# Altium schematic sheet Э3-2 УВ Компаратор.SchDoc
size 594 x 420 mm; Address1: Address1; Address2: Address2; Address3: Address3; Address4: Address4; DocumentNumber: АБВГ.123456.001 Э3; SheetNumber: 3; SheetTotal: 7; Scale: 1:1; DocumentType: Схема электрическая принципиальная; FirstReferrence: АБВГ.123456.001
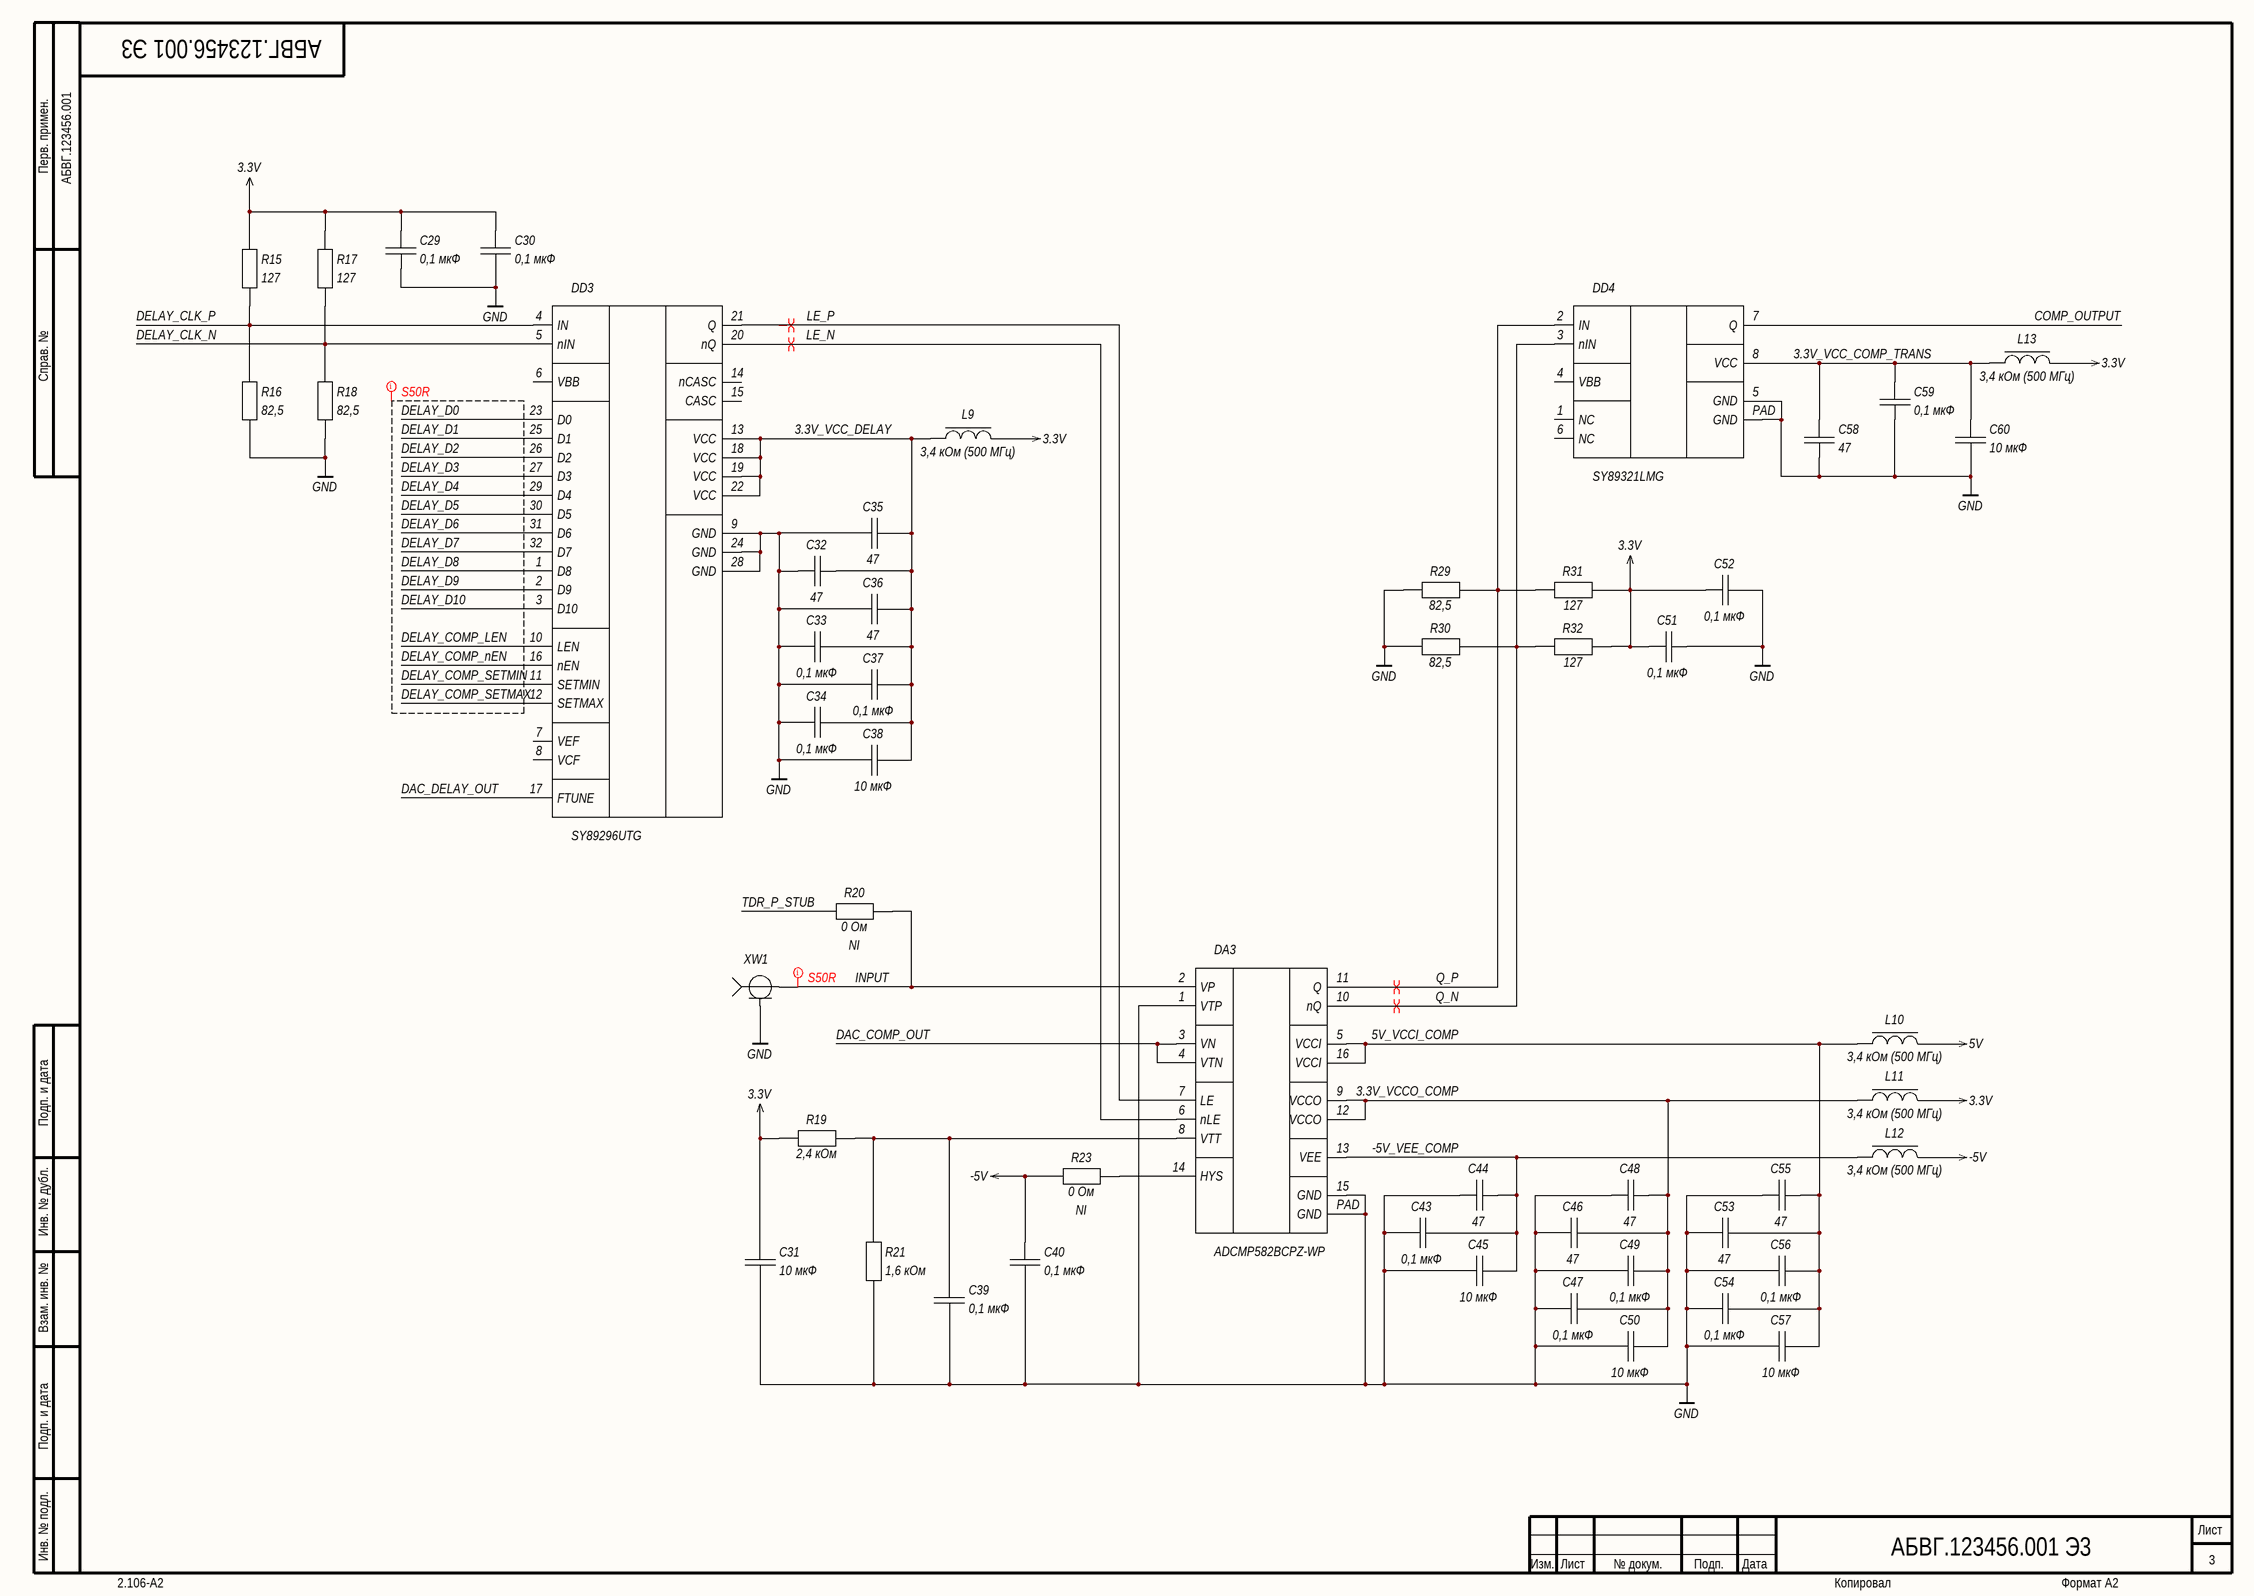
[diagram p0: Э3-2 УВ Компаратор.SchDoc]

## Parts
C29  value 0,1 мкФ  [C0402-B-0.5mm]
C30  value 0,1 мкФ  [C0402-B-0.5mm]
C31  value 10 мкФ  [C0603-B-0.8mm]
C32  value 47  [C0402-B-0.5mm]
C33  value 0,1 мкФ  [C0402-B-0.5mm]
C34  value 0,1 мкФ  [C0402-B-0.5mm]
C35  value 47  [C0402-B-0.5mm]
C36  value 47  [C0402-B-0.5mm]
C37  value 0,1 мкФ  [C0402-B-0.5mm]
C38  value 10 мкФ  [C0603-B-0.8mm]
C39  value 0,1 мкФ  [C0402-B-0.5mm]
C40  value 0,1 мкФ  [C0402-B-0.5mm]
C43  value 0,1 мкФ  [C0402-B-0.5mm]
C44  value 47  [C0402-B-0.5mm]
C45  value 10 мкФ  [C0603-B-0.8mm]
C46  value 47  [C0402-B-0.5mm]
C47  value 0,1 мкФ  [C0402-B-0.5mm]
C48  value 47  [C0402-B-0.5mm]
C49  value 0,1 мкФ  [C0402-B-0.5mm]
C50  value 10 мкФ  [C0603-B-0.8mm]
C51  value 0,1 мкФ  [C0402-B-0.5mm]
C52  value 0,1 мкФ  [C0402-B-0.5mm]
C53  value 47  [C0402-B-0.5mm]
C54  value 0,1 мкФ  [C0402-B-0.5mm]
C55  value 47  [C0402-B-0.5mm]
C56  value 0,1 мкФ  [C0402-B-0.5mm]
C57  value 10 мкФ  [C0603-B-0.8mm]
C58  value 47  [C0402-B-0.5mm]
C59  value 0,1 мкФ  [C0402-B-0.5mm]
C60  value 10 мкФ  [C0603-B-0.8mm]
DA3  ADCMP582BCPZ-WP  [16-LFCSP-3-H0.75]
DD3  SY89296UTG  [32-TQFP-B]
DD4  SY89321LMG  [8-MLF]
L9  value 3,4 кОм (500 МГц)  [L0402-B-0.5mm]
L10  value 3,4 кОм (500 МГц)  [L0402-B-0.5mm]
L11  value 3,4 кОм (500 МГц)  [L0402-B-0.5mm]
L12  value 3,4 кОм (500 МГц)  [L0402-B-0.5mm]
L13  value 3,4 кОм (500 МГц)  [L0402-B-0.5mm]
R15  value 127  [CR0402-B-0.35mm]
R16  value 82,5  [CR0402-B-0.35mm]
R17  value 127  [CR0402-B-0.35mm]
R18  value 82,5  [CR0402-B-0.35mm]
R19  value 2,4 кОм  [CR0402-B-0.35mm]
R20  value 0 Ом  ComponentType: NI  [CR0402-B-0.35mm]
R21  value 1,6 кОм  [CR0402-B-0.35mm]
R23  value 0 Ом  ComponentType: NI  [CR0402-B-0.35mm]
R29  value 82,5  [CR0402-B-0.35mm]
R30  value 82,5  [CR0402-B-0.35mm]
R31  value 127  [CR0402-B-0.35mm]
R32  value 127  [CR0402-B-0.35mm]
XW1  XW(S)  [SMA-J-P-H-ST-EM1]  (value not drawn)

## Nets
3.3V: C29.1 C30.1 C31.1 C51.1 C52.1 L9.2 L11.2 L13.2 R15.1 R17.1 R19.1 R31.2 R32.2
5V: L10.2
-5V: C40.1 L12.2 R23.1
GND: C29.2 C30.2 C31.2 C32.1 C33.1 C34.1 C35.1 C36.1 C37.1 C38.1 C39.2 C40.2 C43.1 C44.1 C45.1 C46.1 C47.1 C48.1 C49.1 C50.1 C51.2 C52.2 C53.1 C54.1 C55.1 C56.1 C57.1 C58.2 C59.2 C60.2 DA3.1(VTP) DA3.15(GND) DA3.PAD(GND) DD3.9(GND) DD3.24(GND) DD3.28(GND) DD4.5(GND) DD4.PAD(GND) R16.2 R18.2 R21.2 R29.1 R30.1 XW1.2
3.3V_VCC_COMP_TRANS: C58.1 C59.1 C60.1 DD4.8(VCC) L13.1
3.3V_VCC_DELAY: C32.2 C33.2 C34.2 C35.2 C36.2 C37.2 C38.2 DD3.13(VCC) DD3.18(VCC) DD3.19(VCC) DD3.22(VCC) L9.1
3.3V_VCCO_COMP: C46.2 C47.2 C48.2 C49.2 C50.2 DA3.9(VCCO) DA3.12(VCCO) L11.1
5V_VCCI_COMP: C53.2 C54.2 C55.2 C56.2 C57.2 DA3.5(VCCI) DA3.16(VCCI) L10.1
-5V_VEE_COMP: C43.2 C44.2 C45.2 DA3.13(VEE) L12.1
COMP_OUTPUT: DD4.7(Q)
DAC_COMP_OUT: DA3.3(VN) DA3.4(VTN)
DAC_DELAY_OUT: DD3.17(FTUNE)
DELAY_CLK_N: DD3.5(nIN) R17.2 R18.1
DELAY_CLK_P: DD3.4(IN) R15.2 R16.1
DELAY_COMP_LEN: DD3.10(LEN)
DELAY_COMP_nEN: DD3.16(nEN)
DELAY_COMP_SETMAX: DD3.12(SETMAX)
DELAY_COMP_SETMIN: DD3.11(SETMIN)
DELAY_D0: DD3.23(D0)
DELAY_D1: DD3.25(D1)
DELAY_D2: DD3.26(D2)
DELAY_D3: DD3.27(D3)
DELAY_D4: DD3.29(D4)
DELAY_D5: DD3.30(D5)
DELAY_D6: DD3.31(D6)
DELAY_D7: DD3.32(D7)
DELAY_D8: DD3.1(D8)
DELAY_D9: DD3.2(D9)
DELAY_D10: DD3.3(D10)
INPUT: DA3.2(VP) R20.1 XW1.1
LE_N: DA3.6(nLE) DD3.20(nQ)
LE_P: DA3.7(LE) DD3.21(Q)
Q_N: DA3.10(nQ) DD4.3(nIN) R30.2 R32.1
Q_P: DA3.11(Q) DD4.2(IN) R29.2 R31.1
TDR_P_STUB: R20.2
NetC39_1: C39.1 DA3.8(VTT) R19.2 R21.1
NetDA3_14: DA3.14(HYS) R23.2

Not connected (* = marked no-connect by the designer): DD3 6(VBB) 7(VEF) 8(VCF) 14(nCASC) 15(CASC); DD4 1(NC) 4(VBB) 6(NC)

## Layout directives
differential pair: LE_N, LE_P, Q_N, Q_P
net class S50R: DELAY_COMP_LEN, DELAY_COMP_nEN, DELAY_COMP_SETMAX, DELAY_COMP_SETMIN, DELAY_D0, DELAY_D1, DELAY_D2, DELAY_D3, DELAY_D4, DELAY_D5, DELAY_D6, DELAY_D7, DELAY_D8, DELAY_D9, DELAY_D10, INPUT

## Notes on the sheet
- Перв. примен.
- Справ. №
- Подп. и дата
- Инв. № дубл.
- Взам. инв. №
- Инв. № подл.
- Изм.
- Лист
- № докум.
- Подп.
- Дата
- 2.106-A2
- Копировал
- Формат А2

## Library data of the parts
C29 C30 C39 C40 C59 = Non Polar Ver.: 0402 X7R 0,1 мкФ ±10 % 50 В; PartNumber: GRM155R71H104KE14D; TemperatureRange: -XX...+XX°C; VoltageRating: 50 В; Manufacturer: *; Package: *; HelpURL: *; Tolerance: *; TypeDielectric: *; ESR: *; ComponentType: CAP
C31 C60 = Non Polar Ver.: 0603 X5R 10 мкФ ±20 % 25 В; PartNumber: GRM188R61E106MA73; TemperatureRange: -XX...+XX°C; VoltageRating: 25 В; Manufacturer: *; Package: *; HelpURL: *; Tolerance: *; TypeDielectric: *; ESR: *; ComponentType: CAP
C32 C35 C36 C44 C46 C48 C53 C55 = Non Polar Hor.: 0402 NP0 47 пФ ±5 % 50 В; PartNumber: GCM1555C1H470JA16; TemperatureRange: -XX...+XX°C; VoltageRating: 50 В; Manufacturer: *; Package: *; HelpURL: *; Tolerance: *; TypeDielectric: *; ESR: *; ComponentType: CAP
C33 C34 C37 C43 C47 C49 C51 C52 C54 C56 = Non Polar Hor.: 0402 X7R 0,1 мкФ ±10 % 50 В; PartNumber: GRM155R71H104KE14D; TemperatureRange: -XX...+XX°C; VoltageRating: 50 В; Manufacturer: *; Package: *; HelpURL: *; Tolerance: *; TypeDielectric: *; ESR: *; ComponentType: CAP
C38 C45 C50 C57 = Non Polar Hor.: 0603 X5R 10 мкФ ±20 % 25 В; PartNumber: GRM188R61E106MA73; TemperatureRange: -XX...+XX°C; VoltageRating: 25 В; Manufacturer: *; Package: *; HelpURL: *; Tolerance: *; TypeDielectric: *; ESR: *; ComponentType: CAP
C58 = Non Polar Ver.: 0402 NP0 47 пФ ±5 % 50 В; PartNumber: GCM1555C1H470JA16; TemperatureRange: -XX...+XX°C; VoltageRating: 50 В; Manufacturer: *; Package: *; HelpURL: *; Tolerance: *; TypeDielectric: *; ESR: *; ComponentType: CAP
DA3 = ADCMP582: Ultrafast SiGe Voltage Comparators; Manufacturer: Analog Devices, Inc.; TemperatureRange: -40...+125°C; Package: 16-LFCSP; PartNumber: ADCMP582BCPZ-WP; ComponentType: IC; DatasheetURL: *; HelpURL: *; PinCount: 16
DD3 = SY89296UTG: 2.5V/3.3V, 1.5 GHz, LVPECL Programmable Delay with Fine Tune Control; Manufacturer: Microchip; TemperatureRange: -40...+85°C; Package: 32-TQFP; DatasheetURL: *; HelpURL: *; PinCount: 32; PartNumber: SY89296UTG; ComponentType: IC
DD4 = SY89321L: 3.3V DIFFERENTIAL LVPECL/CML/LVDS-to-LVTTL TRANSLATOR; Manufacturer: Microchip Technology; TemperatureRange: -40...+85°C; Package: 8-MLF; PartNumber: SY89321LMG; ComponentType: IC; DatasheetURL: *; HelpURL: *; PinCount: 8
L9-L13 = Inductor MC Hor.: PartNumber: BLM15HD182BH1; TemperatureRange: -XX...+XX°C; Manufacturer: *; Package: *; HelpURL: *; MaxCurrent: *; ComponentType: IND; DatasheetURL: *; PinCount: 2
R15 R17 = Resistor Ver.: 0402 127 Ом ±1 %; TemperatureRange: -XX...+XX°C; Manufacturer: *; PartNumber: *; Package: *; HelpURL: *; PowerRating: *; DatasheetURL: *; Tolerance: *; ComponentType: RES
R16 R18 = Resistor Ver.: 0402 82,5 Ом ±1 %; TemperatureRange: -XX...+XX°C; Manufacturer: *; PartNumber: *; Package: *; HelpURL: *; PowerRating: *; DatasheetURL: *; Tolerance: *; ComponentType: RES
R19 = Resistor Hor.: 0402 2,4 кОм ±1 %; TemperatureRange: -XX...+XX°C; Manufacturer: *; PartNumber: *; Package: *; HelpURL: *; PowerRating: *; Tolerance: *; DatasheetURL: *; ComponentType: RES
R20 R23 = Resistor Hor.: 0402 0 Ом; TemperatureRange: -XX...+XX°C; Manufacturer: *; PartNumber: *; Package: *; HelpURL: *; PowerRating: *; Tolerance: *; DatasheetURL: *
R21 = Resistor Ver.: 0402 1,6 кОм ±1 %; TemperatureRange: -XX...+XX°C; Manufacturer: *; PartNumber: *; Package: *; HelpURL: *; PowerRating: *; DatasheetURL: *; Tolerance: *; ComponentType: RES
R29 R30 = Resistor Hor.: 0402 82,5 Ом ±1 %; TemperatureRange: -XX...+XX°C; Manufacturer: *; PartNumber: *; Package: *; HelpURL: *; PowerRating: *; Tolerance: *; DatasheetURL: *; ComponentType: RES
R31 R32 = Resistor Hor.: 0402 127 Ом ±1 %; TemperatureRange: -XX...+XX°C; Manufacturer: *; PartNumber: *; Package: *; HelpURL: *; PowerRating: *; Tolerance: *; DatasheetURL: *; ComponentType: RES
XW1 = XW(S): TemperatureRange: -XX...+XX°C; Manufacturer: *; Package: *; HelpURL: *; DatasheetURL: *; PartNumber: *; PinCount: 2; ComponentType: Connector